# Altium schematic sheet CAN.SchDoc
size A
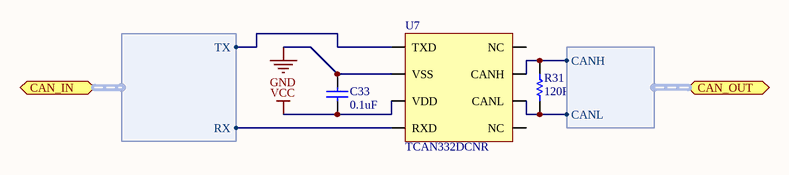
[diagram p0: CAN.SchDoc]

## Parts
C33  value 0.1uF  [C0402[1005X55]]  (hidden comment: 0.1uF 6.3V 0402)
R31  value 120R  [R0402[1005]]  (hidden comment: 120R 1% 0402)
U7  TCAN332DCNR  [SOT-23-8]

## Ports
CAN_IN (harness CAN Input), CAN_OUT (harness CAN Output)

## Harnesses
CAN Input: TX, RX
CAN Output: CANH, CANL

## Nets
GND: C33.1 U7.2(VSS)
VCC: C33.2 U7.3(VDD)
NetR31_1: R31.1 U7.6(CANL) ; port CAN_OUT.CANL
NetR31_2: R31.2 U7.7(CANH) ; port CAN_OUT.CANH
NetU7_1: U7.1(TXD) ; port CAN_IN.TX
NetU7_4: U7.4(RXD) ; port CAN_IN.RX

Not connected (* = marked no-connect by the designer): U7 5(NC) 8(NC)

## Library data of the parts
C33 = CAP_0.1uF_6.3V_0402_10%: 0.1uF 6.3V 10% 0402 (1005 Metric); PartNumber: GRM155R70J104KA01D; Manufacturer: Murata; Tolerance: 10%; Mounting Technology: Surface Mount; PackageReference: 0402; PackageDescription: 0402 (1005 Metric); Voltage: 6.3V
R31 = RES_120R_0402_1%: 120R 0.063W 1% 0402 (1005 Metric); Manufacturer: KOA Speer; PartNumber: RK73H1ETTP1200F; Tolerance: 1%; Power: 0.063W; Mounting Technology: Surface Mount; PackageReference: 0402; PackageDescription: 0402 (1005 Metric); ComponentLink1Description: Datasheet; ComponentLink1URL: http://www.koaspeer.com/catimages/Products/RK73H/RK73H.pdf
U7 = TCAN332DCNR: CAN Interface IC 3.3-V CAN Transceivers with CAN FD (Flexible Data Rate) 8-SOT-23 -40 to 125; Manufacturer: Texas Instruments; Mounting Technology: Surface Mount; PackageReference: SOT-23-8; PartNumber: TCAN332DCNR; PackageDescription: SOT23, 8-Leads